# Altium schematic sheet LPCB235 - ASI RS485.SchDoc
size A3; Address1: Factory 10; Address2: 9-13 Dingley Avenue, Dandeong, VICTORIA 3175, AUSTRALIA; DocumentNumber: 3; Revision: 1; SheetNumber: 3; SheetTotal: 37; Lockie__PCB_SUB_ASSEMBLY: ASI RS485 Link; Lockie__PCB_ASSEMBLY: FCU PCB; Lockie__LDL: LPCB235; Lockie__PCB_DESCRIPTION: Flight Control Unit
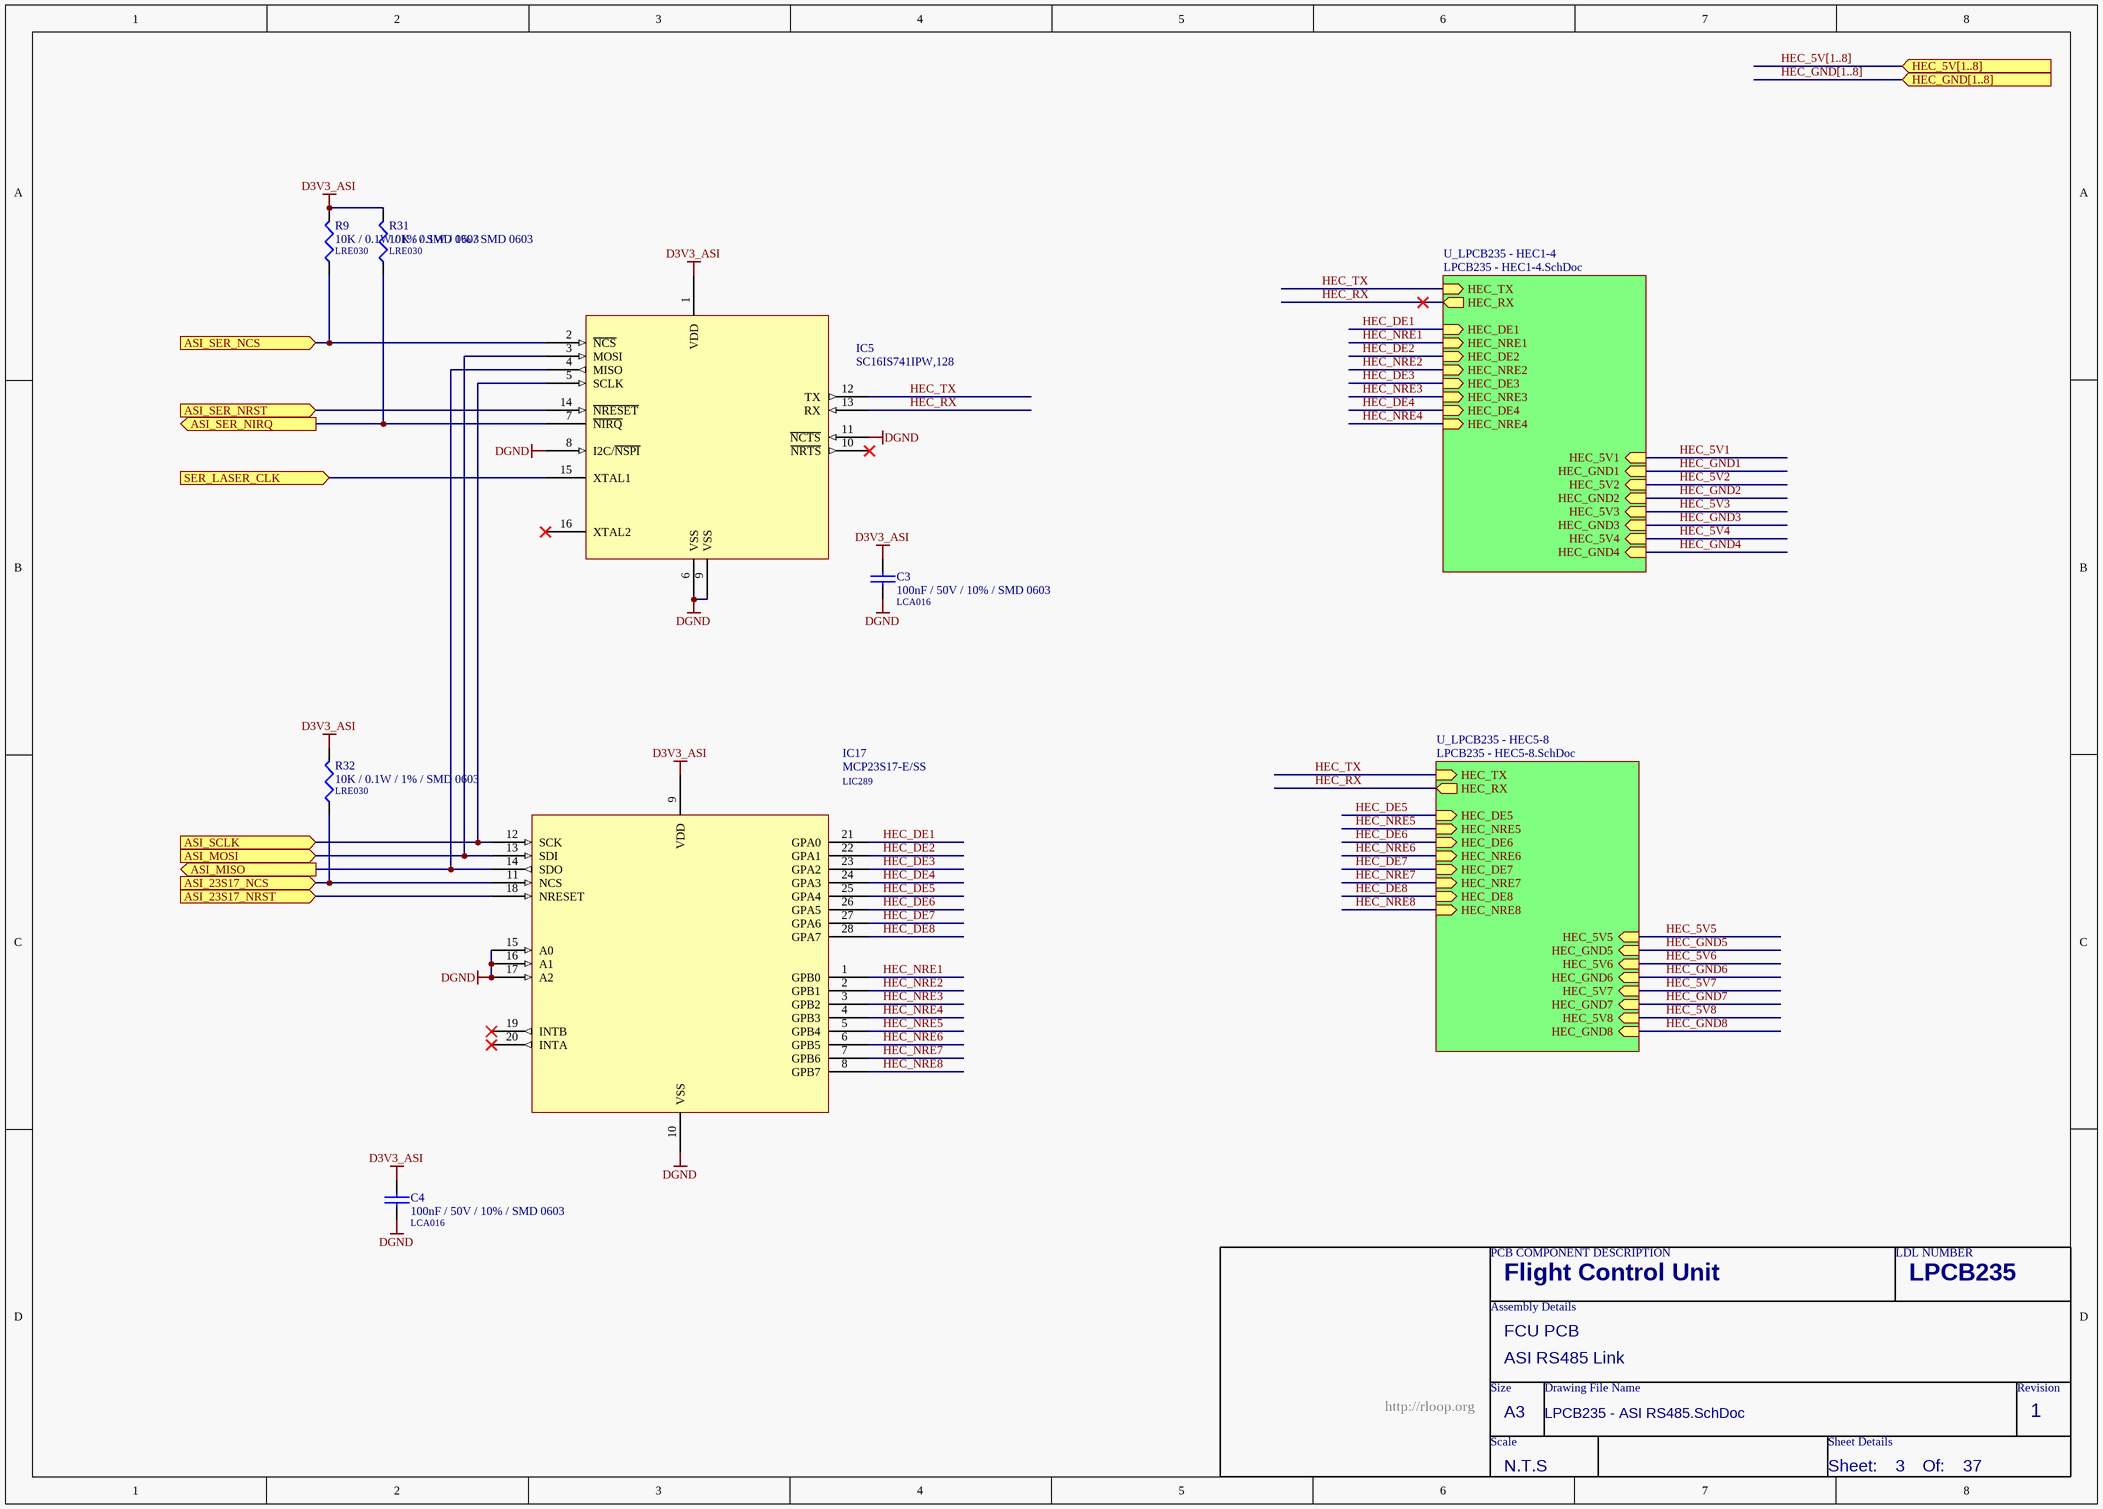
[diagram p0: LPCB235 - ASI RS485.SchDoc]

## Parts
C3  100nF / 50V / 10% / SMD 0603  LDL_NUMBER: LCA016  [LFP011__CC1608-0603-IPC7351_B]
C4  100nF / 50V / 10% / SMD 0603  LDL_NUMBER: LCA016  [LFP011__CC1608-0603-IPC7351_B]
IC5  SC16IS741IPW,128  [LFP049__TSSOP-16]
IC17  MCP23S17-E/SS  LDL_NUMBER: LIC289  [LFP050__SSOP28]
R9  10K / 0.1W / 1% / SMD 0603  LDL_NUMBER: LRE030  [LFP020__CR1608-0603-IPC7351_B]
R31  10K / 0.1W / 1% / SMD 0603  LDL_NUMBER: LRE030  [LFP020__CR1608-0603-IPC7351_B]
R32  10K / 0.1W / 1% / SMD 0603  LDL_NUMBER: LRE030  [LFP020__CR1608-0603-IPC7351_B]

## Sub-sheets
U_LPCB235 - HEC1-4 = LPCB235 - HEC1-4.SchDoc: HEC_RX (out), HEC_TX (in), HEC_DE1 (in), HEC_NRE1 (in), HEC_DE2 (in), HEC_NRE2 (in), HEC_DE3 (in), HEC_NRE3 (in), HEC_DE4 (in), HEC_NRE4 (in), HEC_5V1 (in), HEC_GND1 (in), HEC_5V2 (in), HEC_GND2 (in), HEC_5V3 (in), HEC_GND3 (in), HEC_5V4 (in), HEC_GND4 (in)
U_LPCB235 - HEC5-8 = LPCB235 - HEC5-8.SchDoc: HEC_RX (out), HEC_TX (in), HEC_DE5 (in), HEC_NRE5 (in), HEC_DE6 (in), HEC_NRE6 (in), HEC_DE7 (in), HEC_NRE7 (in), HEC_DE8 (in), HEC_NRE8 (in), HEC_5V5 (in), HEC_GND5 (in), HEC_5V6 (in), HEC_GND6 (in), HEC_5V7 (in), HEC_GND7 (in), HEC_5V8 (in), HEC_GND8 (in)

## Ports
ASI_23S17_NCS (in), ASI_23S17_NRST (in), ASI_MISO (out), ASI_MOSI (in), ASI_SCLK (in), ASI_SER_NCS (in), ASI_SER_NIRQ (out), ASI_SER_NRST (in), HEC_5V[1..8] (in), HEC_GND[1..8] (in), SER_LASER_CLK (in)

## Nets
D3V3_ASI: C3.1 C4.1 IC5.1(VDD) IC17.9(VDD) R9.2 R31.2 R32.2
DGND: C3.2 C4.2 IC5.6(VSS) IC5.8(I2C/~{NSPI}) IC5.9(VSS) IC5.11(~{NCTS}) IC17.10(VSS) IC17.15(A0) IC17.16(A1) IC17.17(A2)
ASI_23S17_NCS: IC17.11(NCS) R32.1 ; port ASI_23S17_NCS
ASI_23S17_NRST: IC17.18(NRESET) ; port ASI_23S17_NRST
ASI_MISO: IC5.4(MISO) IC17.14(SDO) ; port ASI_MISO
ASI_MOSI: IC5.3(MOSI) IC17.13(SDI) ; port ASI_MOSI
ASI_SCLK: IC5.5(SCLK) IC17.12(SCK) ; port ASI_SCLK
ASI_SER_NCS: IC5.2(~{NCS}) R9.1 ; port ASI_SER_NCS
ASI_SER_NIRQ: IC5.7(~{NIRQ}) R31.1 ; port ASI_SER_NIRQ
ASI_SER_NRST: IC5.14(~{NRESET}) ; port ASI_SER_NRST
HEC_5V1: sheet U_LPCB235 - HEC1-4/HEC_5V1
HEC_5V2: sheet U_LPCB235 - HEC1-4/HEC_5V2
HEC_5V3: sheet U_LPCB235 - HEC1-4/HEC_5V3
HEC_5V4: sheet U_LPCB235 - HEC1-4/HEC_5V4
HEC_5V5: sheet U_LPCB235 - HEC5-8/HEC_5V5
HEC_5V6: sheet U_LPCB235 - HEC5-8/HEC_5V6
HEC_5V7: sheet U_LPCB235 - HEC5-8/HEC_5V7
HEC_5V8: sheet U_LPCB235 - HEC5-8/HEC_5V8
HEC_DE1: IC17.21(GPA0) ; sheet U_LPCB235 - HEC1-4/HEC_DE1
HEC_DE2: IC17.22(GPA1) ; sheet U_LPCB235 - HEC1-4/HEC_DE2
HEC_DE3: IC17.23(GPA2) ; sheet U_LPCB235 - HEC1-4/HEC_DE3
HEC_DE4: IC17.24(GPA3) ; sheet U_LPCB235 - HEC1-4/HEC_DE4
HEC_DE5: IC17.25(GPA4) ; sheet U_LPCB235 - HEC5-8/HEC_DE5
HEC_DE6: IC17.26(GPA5) ; sheet U_LPCB235 - HEC5-8/HEC_DE6
HEC_DE7: IC17.27(GPA6) ; sheet U_LPCB235 - HEC5-8/HEC_DE7
HEC_DE8: IC17.28(GPA7) ; sheet U_LPCB235 - HEC5-8/HEC_DE8
HEC_GND1: sheet U_LPCB235 - HEC1-4/HEC_GND1
HEC_GND2: sheet U_LPCB235 - HEC1-4/HEC_GND2
HEC_GND3: sheet U_LPCB235 - HEC1-4/HEC_GND3
HEC_GND4: sheet U_LPCB235 - HEC1-4/HEC_GND4
HEC_GND5: sheet U_LPCB235 - HEC5-8/HEC_GND5
HEC_GND6: sheet U_LPCB235 - HEC5-8/HEC_GND6
HEC_GND7: sheet U_LPCB235 - HEC5-8/HEC_GND7
HEC_GND8: sheet U_LPCB235 - HEC5-8/HEC_GND8
HEC_NRE1: IC17.1(GPB0) ; sheet U_LPCB235 - HEC1-4/HEC_NRE1
HEC_NRE2: IC17.2(GPB1) ; sheet U_LPCB235 - HEC1-4/HEC_NRE2
HEC_NRE3: IC17.3(GPB2) ; sheet U_LPCB235 - HEC1-4/HEC_NRE3
HEC_NRE4: IC17.4(GPB3) ; sheet U_LPCB235 - HEC1-4/HEC_NRE4
HEC_NRE5: IC17.5(GPB4) ; sheet U_LPCB235 - HEC5-8/HEC_NRE5
HEC_NRE6: IC17.6(GPB5) ; sheet U_LPCB235 - HEC5-8/HEC_NRE6
HEC_NRE7: IC17.7(GPB6) ; sheet U_LPCB235 - HEC5-8/HEC_NRE7
HEC_NRE8: IC17.8(GPB7) ; sheet U_LPCB235 - HEC5-8/HEC_NRE8
HEC_RX: IC5.13(RX) ; sheet U_LPCB235 - HEC1-4/HEC_RX, sheet U_LPCB235 - HEC5-8/HEC_RX
HEC_TX: IC5.12(TX) ; sheet U_LPCB235 - HEC1-4/HEC_TX, sheet U_LPCB235 - HEC5-8/HEC_TX
SER_LASER_CLK: IC5.15(XTAL1) ; port SER_LASER_CLK

Not connected (* = marked no-connect by the designer): IC5 10(~{NRTS})* 16(XTAL2)*; IC17 19(INTB)* 20(INTA)*

## Buses and harness runs
bus HEC_5V[1..8] = port HEC_5V[1..8]
bus HEC_GND[1..8] = port HEC_GND[1..8]

## Notes on the sheet
- PCB COMPONENT DESCRIPTION
- LDL NUMBER
- Assembly Details
- Size
- Drawing File Name
- Revision
- http://rloop.org
- Scale
- A3
- Sheet Details
- N.T.S
- Sheet:
- Of:

## Library data of the parts
C3 C4 = 100nF / 50V / 10% / SMD 0603: Capacitor, Ceramic Chip, 100nF (0.1uF), 50V, 5%, SMD 0603 [LCA016]; Value: 100n; FMEDA__OPERATING__VOLTAGE_MIN: 0; FMEDA__OPERATING__VOLTAGE_MAX: 3.3; FMEDA__OPERATING__TEMP_MIN: -20; FMEDA__OPERATING__TEMP_TYP: 27; FMEDA__OPERATING__TEMP_MAX: 50; FMEDA__CHANNEL: COM; FMEDA__FUNCTION_IN_SYSTEM: *; FMEDA__OPERATING__VOLTAGE_TYP: 3.3
IC5 = SC16IS741IPW,128: IC, SPI to UART bridge [LIC472]; FMEDA__CHANNEL: COM; LDL_NUMBER: LIC472; FMEDA__FUNCTION_IN_SYSTEM: *
IC17 = MCP23S17-E/SS: IC, SPI IO Expander, 16bit, SMD SSOP28 [LIC289]; FMEDA__OPERATING__TEMP_MIN: -20; FMEDA__OPERATING__TEMP_TYP: 27; FMEDA__OPERATING__TEMP_MAX: 50; FMEDA__OPERATING__VOLTAGE_MIN: 0; FMEDA__OPERATING__VOLTAGE_TYP: 3.3; FMEDA__CHANNEL: COM; FMEDA__FUNCTION_IN_SYSTEM: *; FMEDA__OPERATING__VOLTAGE_MAX: 3.3
R9 R31 R32 = 10K / 0.1W / 1% / SMD 0603: Resistor, Ceramic Chip, 10K, 0.1W, 1%, SMD 0603 [LRE030]; FMEDA__OPERATING__POWER_MAX: 0; FMEDA__OPERATING__TEMP_MAX: 50; FMEDA__OPERATING__TEMP_MIN: -20; FMEDA__OPERATING__TEMP_TYP: 27; FMEDA__CHANNEL: COM; Value: 10K; FMEDA__OPERATING__POWER_MIN: 0; FMEDA__OPERATING__VOLTAGE_MAX: 0; FMEDA__OPERATING__VOLTAGE_MIN: 0; FMEDA__OPERATING__VOLTAGE_TYP: 0; FMEDA__FUNCTION_IN_SYSTEM: *